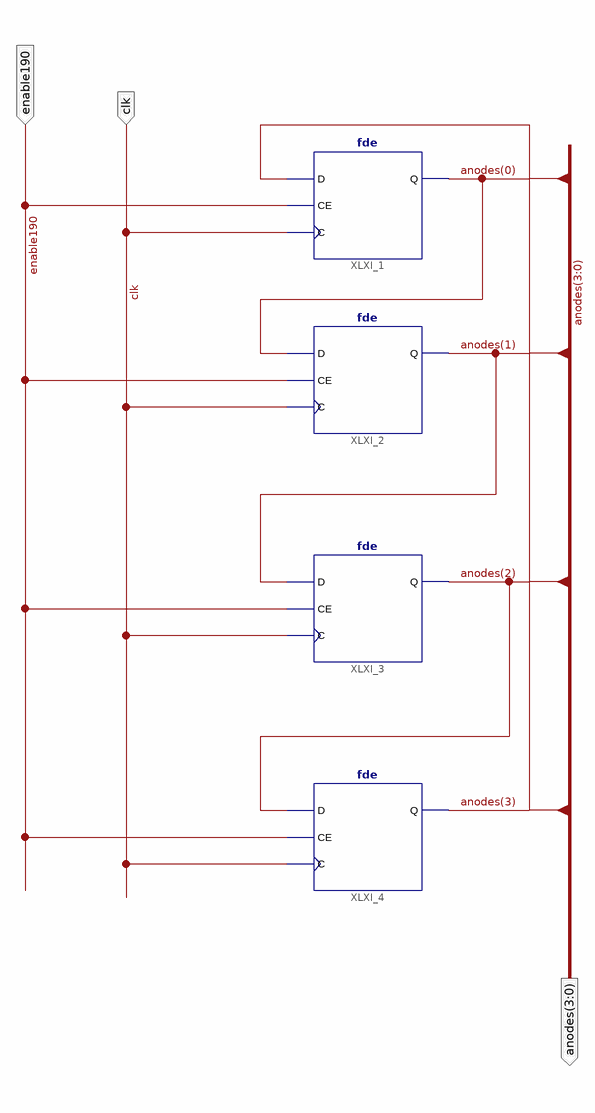
[diagram p0: schematic sheet 1]
// Xilinx ISE schematic shiftanodes.sch (spartan6) as structural Verilog: 4 symbols, 3 ports
module shiftanodes (
  input  clk,
  input  enable190,
  output [3:0] anodes
);

  fde #(.INIT("1")) XLXI_2 (.C(clk), .CE(enable190), .D(anodes[0]), .Q(anodes[1]));
  fde #(.INIT("1")) XLXI_3 (.C(clk), .CE(enable190), .D(anodes[1]), .Q(anodes[2]));
  fde #(.INIT("1")) XLXI_4 (.C(clk), .CE(enable190), .D(anodes[2]), .Q(anodes[3]));
  fde #(.INIT("0")) XLXI_1 (.C(clk), .CE(enable190), .D(anodes[3]), .Q(anodes[0]));
endmodule
